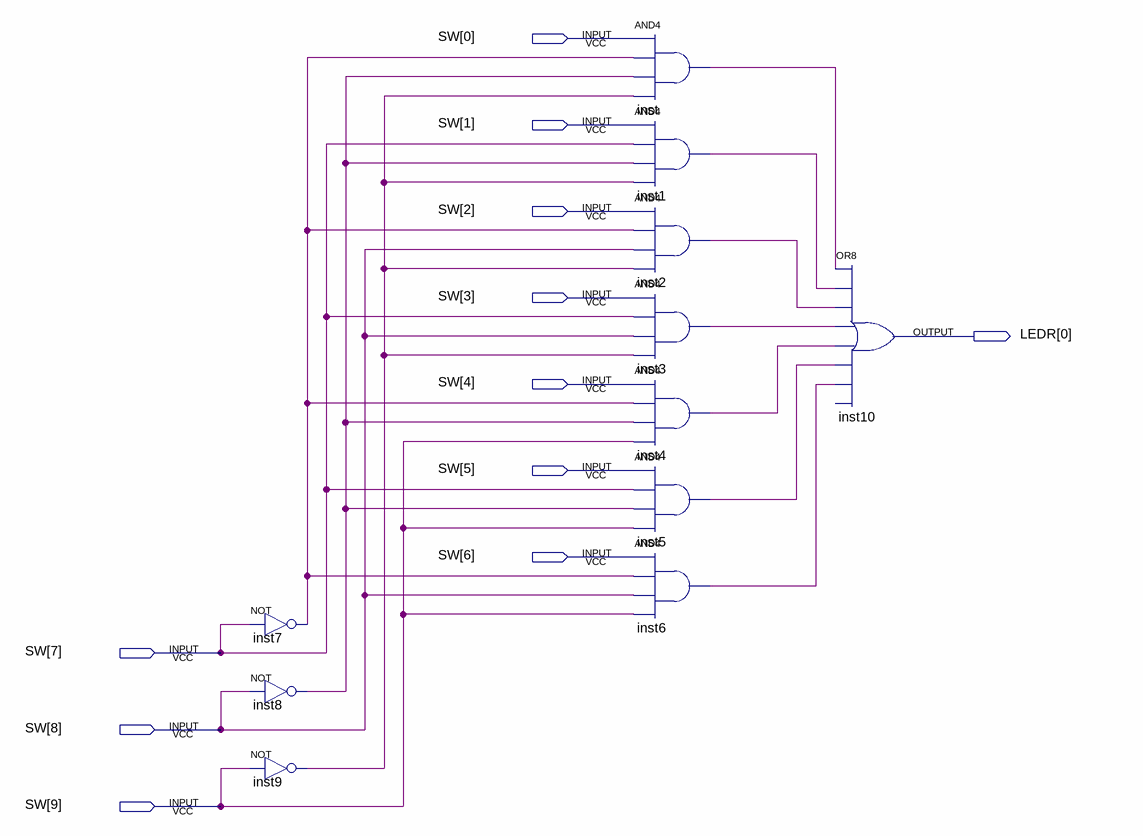
[diagram p0: schematic sheet]
// Quartus schematic sevenToOneMux.bdf as structural Verilog: 11 symbols, 11 pins
module sevenToOneMux (
  input  [9:0] SW,
  output [0:0] LEDR
);

  wire inst1_out, inst2_out, inst3_out, inst4_out, inst5_out, inst6_out, inst7_out, inst8_out, inst9_out,
       inst_out;

  not inst7 (inst7_out, SW[7]);
  not inst8 (inst8_out, SW[8]);
  not inst9 (inst9_out, SW[9]);
  and inst (inst_out, SW[0], inst7_out, inst8_out, inst9_out);
  and inst1 (inst1_out, SW[1], SW[7], inst8_out, inst9_out);
  and inst2 (inst2_out, SW[2], inst7_out, SW[8], inst9_out);
  and inst3 (inst3_out, SW[3], SW[7], SW[8], inst9_out);
  and inst4 (inst4_out, SW[4], inst7_out, inst8_out, SW[9]);
  and inst5 (inst5_out, SW[5], SW[7], inst8_out, SW[9]);
  and inst6 (inst6_out, SW[6], inst7_out, SW[8], SW[9]);
  or inst10 (LEDR[0], inst_out, inst1_out, inst2_out, inst3_out, inst4_out, inst5_out, inst6_out);  // open: IN8
endmodule
